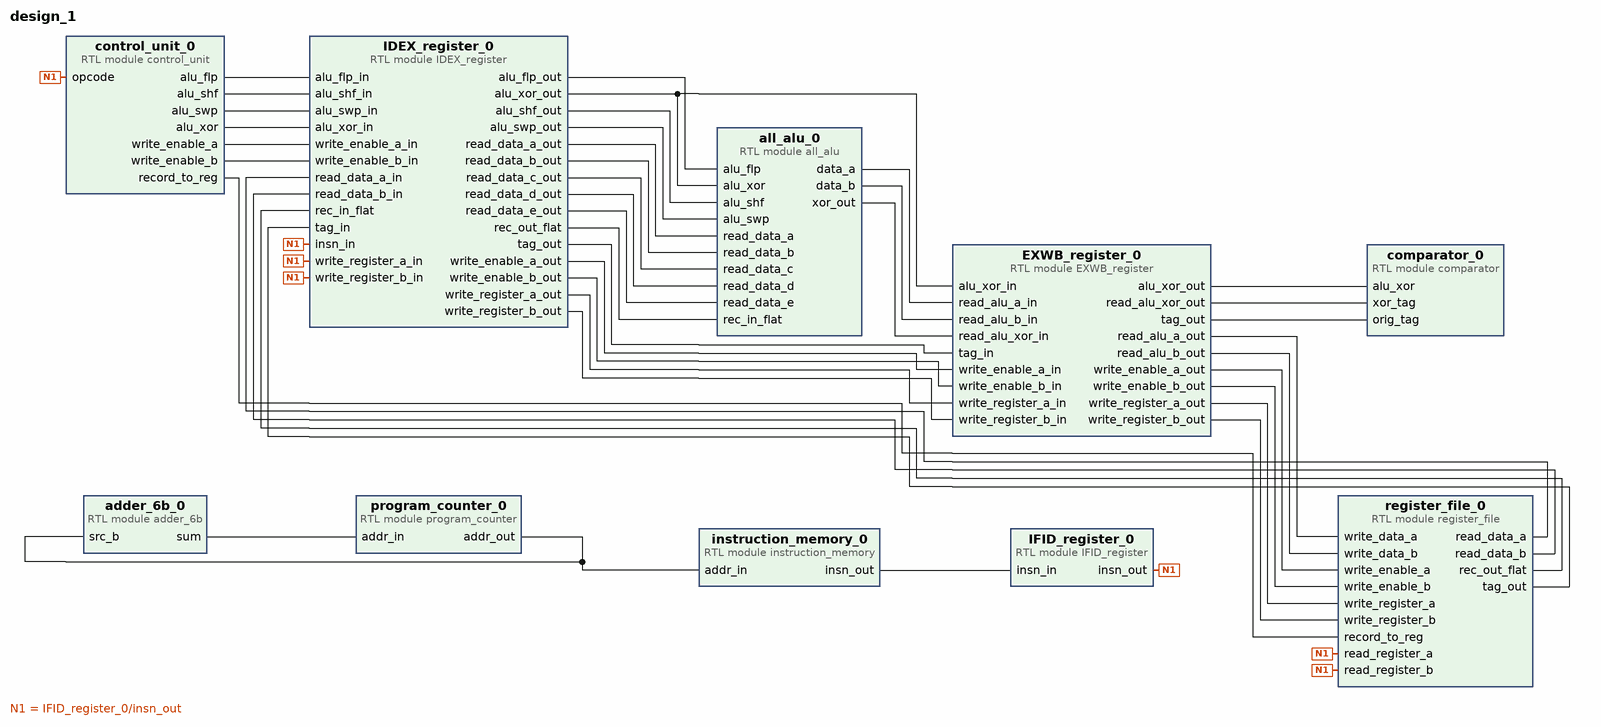
[diagram p0: block diagram of the top level]
# Vivado block design design_1, xc7a35tcpg236-1, Vivado 2024.1
create_bd_design design_1

create_bd_cell -type module -reference program_counter program_counter_0
create_bd_cell -type module -reference adder_6b adder_6b_0
create_bd_cell -type module -reference instruction_memory instruction_memory_0
create_bd_cell -type module -reference IFID_register IFID_register_0
create_bd_cell -type module -reference control_unit control_unit_0
create_bd_cell -type module -reference register_file register_file_0
create_bd_cell -type module -reference IDEX_register IDEX_register_0
create_bd_cell -type module -reference all_alu all_alu_0
create_bd_cell -type module -reference EXWB_register EXWB_register_0
create_bd_cell -type module -reference comparator comparator_0

# ---- connections ----

connect_bd_net [get_bd_pins EXWB_register_0/alu_xor_out] [get_bd_pins comparator_0/alu_xor]
connect_bd_net [get_bd_pins EXWB_register_0/read_alu_a_out] [get_bd_pins register_file_0/write_data_a]
connect_bd_net [get_bd_pins EXWB_register_0/read_alu_b_out] [get_bd_pins register_file_0/write_data_b]
connect_bd_net [get_bd_pins EXWB_register_0/read_alu_xor_out] [get_bd_pins comparator_0/xor_tag]
connect_bd_net [get_bd_pins EXWB_register_0/tag_out] [get_bd_pins comparator_0/orig_tag]
connect_bd_net [get_bd_pins EXWB_register_0/write_enable_a_out] [get_bd_pins register_file_0/write_enable_a]
connect_bd_net [get_bd_pins EXWB_register_0/write_enable_b_out] [get_bd_pins register_file_0/write_enable_b]
connect_bd_net [get_bd_pins EXWB_register_0/write_register_a_out] [get_bd_pins register_file_0/write_register_a]
connect_bd_net [get_bd_pins EXWB_register_0/write_register_b_out] [get_bd_pins register_file_0/write_register_b]
connect_bd_net [get_bd_pins IDEX_register_0/alu_flp_out] [get_bd_pins all_alu_0/alu_flp]
connect_bd_net [get_bd_pins IDEX_register_0/alu_shf_out] [get_bd_pins all_alu_0/alu_shf]
connect_bd_net [get_bd_pins IDEX_register_0/alu_swp_out] [get_bd_pins all_alu_0/alu_swp]
connect_bd_net [get_bd_pins IDEX_register_0/alu_xor_out] [get_bd_pins EXWB_register_0/alu_xor_in] [get_bd_pins all_alu_0/alu_xor]
connect_bd_net [get_bd_pins IDEX_register_0/read_data_a_out] [get_bd_pins all_alu_0/read_data_a]
connect_bd_net [get_bd_pins IDEX_register_0/read_data_b_out] [get_bd_pins all_alu_0/read_data_b]
connect_bd_net [get_bd_pins IDEX_register_0/read_data_c_out] [get_bd_pins all_alu_0/read_data_c]
connect_bd_net [get_bd_pins IDEX_register_0/read_data_d_out] [get_bd_pins all_alu_0/read_data_d]
connect_bd_net [get_bd_pins IDEX_register_0/read_data_e_out] [get_bd_pins all_alu_0/read_data_e]
connect_bd_net [get_bd_pins IDEX_register_0/rec_out_flat] [get_bd_pins all_alu_0/rec_in_flat]
connect_bd_net [get_bd_pins IDEX_register_0/tag_out] [get_bd_pins EXWB_register_0/tag_in]
connect_bd_net [get_bd_pins IDEX_register_0/write_enable_a_out] [get_bd_pins EXWB_register_0/write_enable_a_in]
connect_bd_net [get_bd_pins IDEX_register_0/write_enable_b_out] [get_bd_pins EXWB_register_0/write_enable_b_in]
connect_bd_net [get_bd_pins IDEX_register_0/write_register_a_out] [get_bd_pins EXWB_register_0/write_register_a_in]
connect_bd_net [get_bd_pins IDEX_register_0/write_register_b_out] [get_bd_pins EXWB_register_0/write_register_b_in]
connect_bd_net [get_bd_pins IFID_register_0/insn_out] \
  [get_bd_pins IDEX_register_0/write_register_a_in] [get_bd_pins IDEX_register_0/write_register_b_in] \
  [get_bd_pins IDEX_register_0/insn_in] [get_bd_pins control_unit_0/opcode] [get_bd_pins register_file_0/read_register_a] \
  [get_bd_pins register_file_0/read_register_b]
connect_bd_net [get_bd_pins adder_6b_0/sum] [get_bd_pins program_counter_0/addr_in]
connect_bd_net [get_bd_pins all_alu_0/data_a] [get_bd_pins EXWB_register_0/read_alu_a_in]
connect_bd_net [get_bd_pins all_alu_0/data_b] [get_bd_pins EXWB_register_0/read_alu_b_in]
connect_bd_net [get_bd_pins all_alu_0/xor_out] [get_bd_pins EXWB_register_0/read_alu_xor_in]
connect_bd_net [get_bd_pins control_unit_0/alu_flp] [get_bd_pins IDEX_register_0/alu_flp_in]
connect_bd_net [get_bd_pins control_unit_0/alu_shf] [get_bd_pins IDEX_register_0/alu_shf_in]
connect_bd_net [get_bd_pins control_unit_0/alu_swp] [get_bd_pins IDEX_register_0/alu_swp_in]
connect_bd_net [get_bd_pins control_unit_0/alu_xor] [get_bd_pins IDEX_register_0/alu_xor_in]
connect_bd_net [get_bd_pins control_unit_0/record_to_reg] [get_bd_pins register_file_0/record_to_reg]
connect_bd_net [get_bd_pins control_unit_0/write_enable_a] [get_bd_pins IDEX_register_0/write_enable_a_in]
connect_bd_net [get_bd_pins control_unit_0/write_enable_b] [get_bd_pins IDEX_register_0/write_enable_b_in]
connect_bd_net [get_bd_pins instruction_memory_0/insn_out] [get_bd_pins IFID_register_0/insn_in]
connect_bd_net [get_bd_pins program_counter_0/addr_out] [get_bd_pins adder_6b_0/src_b] [get_bd_pins instruction_memory_0/addr_in]
connect_bd_net [get_bd_pins register_file_0/read_data_a] [get_bd_pins IDEX_register_0/read_data_a_in]
connect_bd_net [get_bd_pins register_file_0/read_data_b] [get_bd_pins IDEX_register_0/read_data_b_in]
connect_bd_net [get_bd_pins register_file_0/rec_out_flat] [get_bd_pins IDEX_register_0/rec_in_flat]
connect_bd_net [get_bd_pins register_file_0/tag_out] [get_bd_pins IDEX_register_0/tag_in]

validate_bd_design
save_bd_design
